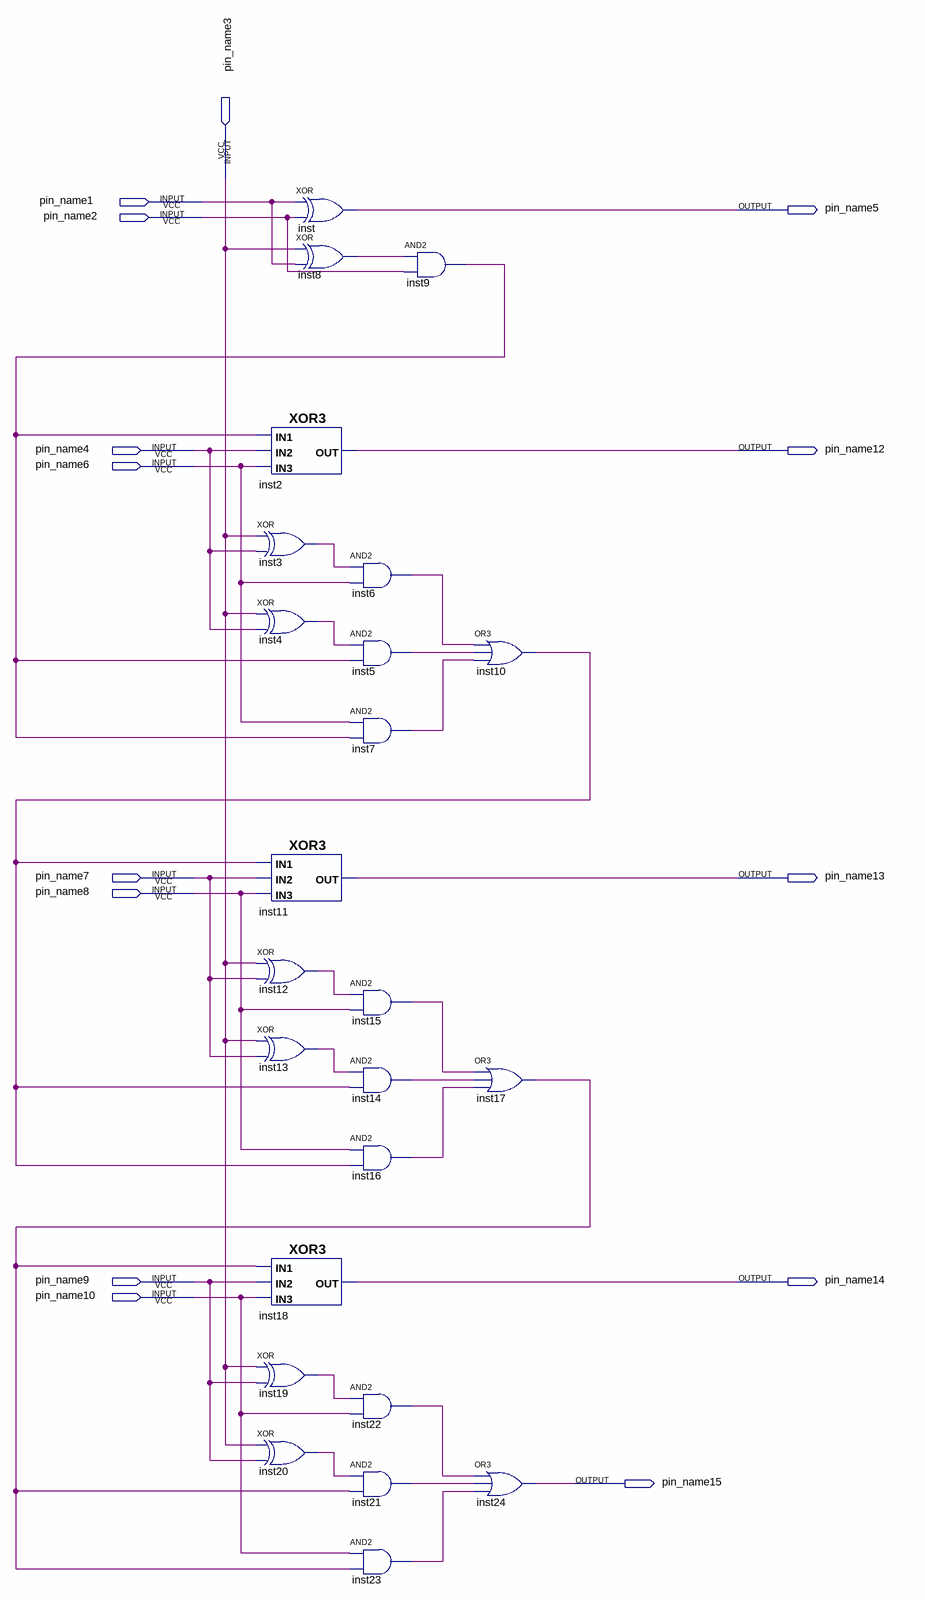
[diagram p0: schematic sheet]
// Quartus schematic somador2.bdf as structural Verilog: 24 symbols, 14 pins
module somador2 (
  input  pin_name3,
  input  pin_name1,
  input  pin_name2,
  input  pin_name4,
  input  pin_name6,
  input  pin_name7,
  input  pin_name8,
  input  pin_name9,
  input  pin_name10,
  output pin_name5,
  output pin_name12,
  output pin_name13,
  output pin_name14,
  output pin_name15
);

  wire inst3_out, inst4_out, inst5_out, inst6_out, inst7_out, inst8_out, inst9_out, inst10_out, inst12_out,
       inst13_out, inst14_out, inst15_out, inst16_out, inst17_out, inst19_out, inst20_out, inst21_out,
       inst22_out, inst23_out;

  XOR3 inst2 (.IN3(pin_name6), .IN1(inst9_out), .IN2(pin_name4), .OUT(pin_name12));
  xor inst3 (inst3_out, pin_name3, pin_name4);
  xor inst4 (inst4_out, pin_name3, pin_name4);
  XOR3 inst11 (.IN3(pin_name8), .IN1(inst10_out), .IN2(pin_name7), .OUT(pin_name13));
  xor inst12 (inst12_out, pin_name3, pin_name7);
  xor inst13 (inst13_out, pin_name3, pin_name7);
  XOR3 inst18 (.IN3(pin_name10), .IN1(inst17_out), .IN2(pin_name9), .OUT(pin_name14));
  xor inst19 (inst19_out, pin_name3, pin_name9);
  xor inst20 (inst20_out, pin_name3, pin_name9);
  xor inst (pin_name5, pin_name1, pin_name2);
  xor inst8 (inst8_out, pin_name3, pin_name1);
  and inst6 (inst6_out, inst3_out, pin_name6);
  and inst5 (inst5_out, inst4_out, inst9_out);
  and inst7 (inst7_out, pin_name6, inst9_out);
  and inst15 (inst15_out, inst12_out, pin_name8);
  and inst14 (inst14_out, inst13_out, inst10_out);
  and inst16 (inst16_out, pin_name8, inst10_out);
  and inst22 (inst22_out, inst19_out, pin_name10);
  and inst21 (inst21_out, inst20_out, inst17_out);
  and inst23 (inst23_out, pin_name10, inst17_out);
  and inst9 (inst9_out, inst8_out, pin_name2);
  or inst10 (inst10_out, inst6_out, inst5_out, inst7_out);
  or inst17 (inst17_out, inst15_out, inst14_out, inst16_out);
  or inst24 (pin_name15, inst22_out, inst21_out, inst23_out);
endmodule
